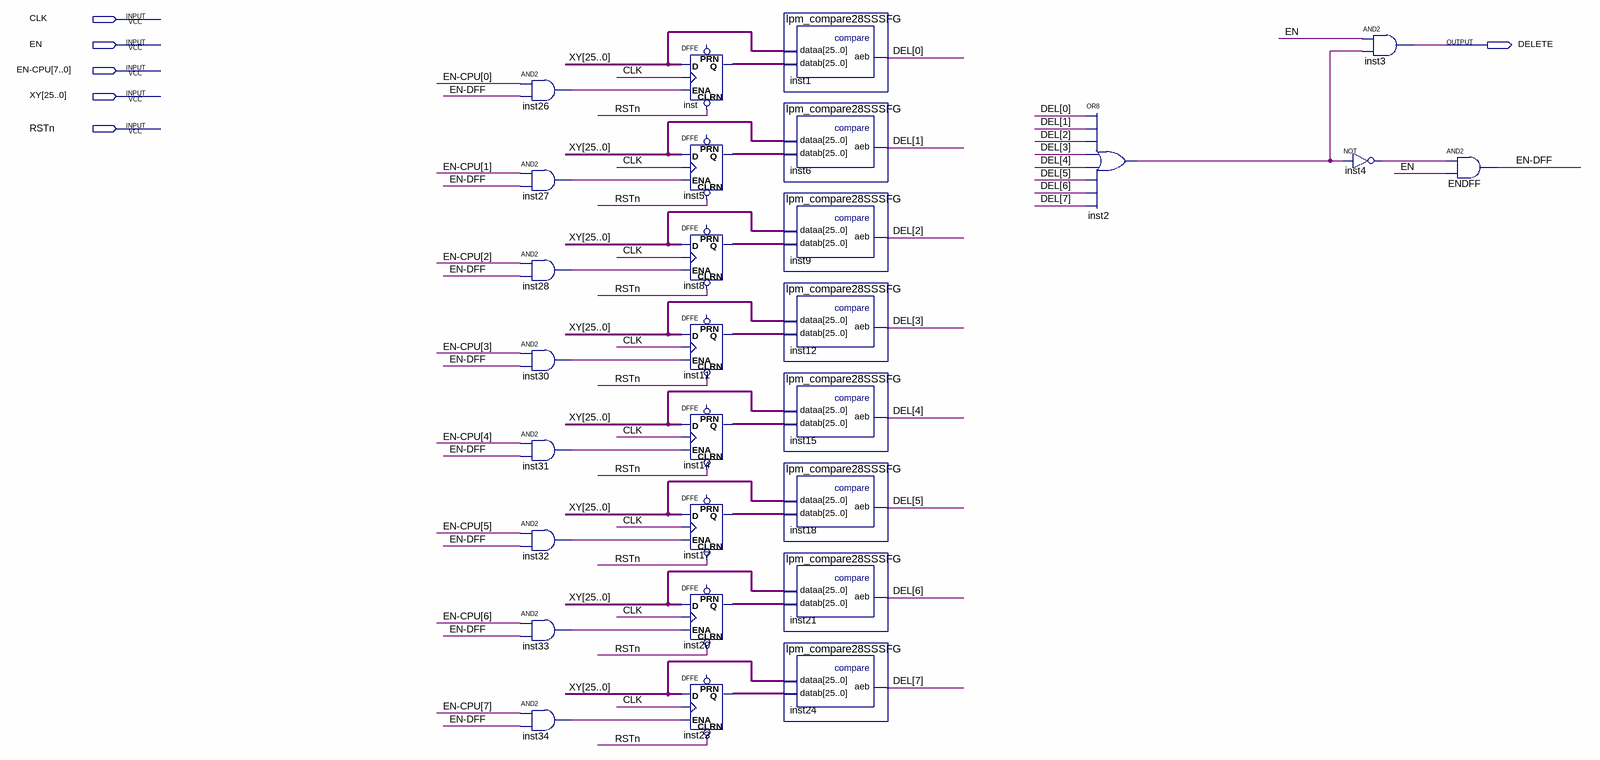
[diagram p0: schematic sheet]
// Quartus schematic DEL-REPEAT.bdf as structural Verilog: 28 symbols, 6 pins
module \DEL-REPEAT  (
  input  CLK,
  input  EN,
  input  [7:0] \EN-CPU ,
  input  [25:0] XY,
  input  RSTn,
  output DELETE
);

  wire \EN-DFF , inst2_out, inst4_out, inst26_out, inst27_out, inst28_out, inst30_out, inst31_out,
       inst32_out, inst33_out, inst34_out;
  wire [7:0] DEL;
  wire [25:0] inst5_q, inst8_q, inst11_q, inst14_q, inst17_q, inst20_q, inst23_q, inst_q;

  and inst26 (inst26_out, \EN-CPU [0], \EN-DFF );
  and inst27 (inst27_out, \EN-CPU [1], \EN-DFF );
  and inst28 (inst28_out, \EN-CPU [2], \EN-DFF );
  and inst30 (inst30_out, \EN-CPU [3], \EN-DFF );
  and inst31 (inst31_out, \EN-CPU [4], \EN-DFF );
  and inst32 (inst32_out, \EN-CPU [5], \EN-DFF );
  and inst33 (inst33_out, \EN-CPU [6], \EN-DFF );
  and inst34 (inst34_out, \EN-CPU [7], \EN-DFF );
  DFFE inst[25:0] (.CLRN(RSTn), .D(XY), .CLK(CLK), .ENA(inst26_out), .Q(inst_q));  // open: PRN
  DFFE inst5[25:0] (.CLRN(RSTn), .D(XY), .CLK(CLK), .ENA(inst27_out), .Q(inst5_q));  // open: PRN
  DFFE inst8[25:0] (.CLRN(RSTn), .D(XY), .CLK(CLK), .ENA(inst28_out), .Q(inst8_q));  // open: PRN
  DFFE inst11[25:0] (.CLRN(RSTn), .D(XY), .CLK(CLK), .ENA(inst30_out), .Q(inst11_q));  // open: PRN
  DFFE inst14[25:0] (.CLRN(RSTn), .D(XY), .CLK(CLK), .ENA(inst31_out), .Q(inst14_q));  // open: PRN
  DFFE inst17[25:0] (.CLRN(RSTn), .D(XY), .CLK(CLK), .ENA(inst32_out), .Q(inst17_q));  // open: PRN
  DFFE inst20[25:0] (.CLRN(RSTn), .D(XY), .CLK(CLK), .ENA(inst33_out), .Q(inst20_q));  // open: PRN
  DFFE inst23[25:0] (.CLRN(RSTn), .D(XY), .CLK(CLK), .ENA(inst34_out), .Q(inst23_q));  // open: PRN
  lpm_compare28SSSFG inst1 (.dataa(XY), .datab(inst_q), .aeb(DEL[0]));
  lpm_compare28SSSFG inst6 (.dataa(XY), .datab(inst5_q), .aeb(DEL[1]));
  lpm_compare28SSSFG inst9 (.dataa(XY), .datab(inst8_q), .aeb(DEL[2]));
  lpm_compare28SSSFG inst12 (.dataa(XY), .datab(inst11_q), .aeb(DEL[3]));
  lpm_compare28SSSFG inst15 (.dataa(XY), .datab(inst14_q), .aeb(DEL[4]));
  lpm_compare28SSSFG inst18 (.dataa(XY), .datab(inst17_q), .aeb(DEL[5]));
  lpm_compare28SSSFG inst21 (.dataa(XY), .datab(inst20_q), .aeb(DEL[6]));
  lpm_compare28SSSFG inst24 (.dataa(XY), .datab(inst23_q), .aeb(DEL[7]));
  or inst2 (inst2_out, DEL[0], DEL[1], DEL[2], DEL[3], DEL[4], DEL[5], DEL[6], DEL[7]);
  and inst3 (DELETE, EN, inst2_out);
  not inst4 (inst4_out, inst2_out);
  and ENDFF (\EN-DFF , inst4_out, EN);
endmodule
